# Altium schematic sheet 华怡丰ES201-D300N 2022版手抄原理图-20260610.SchDoc
size A4
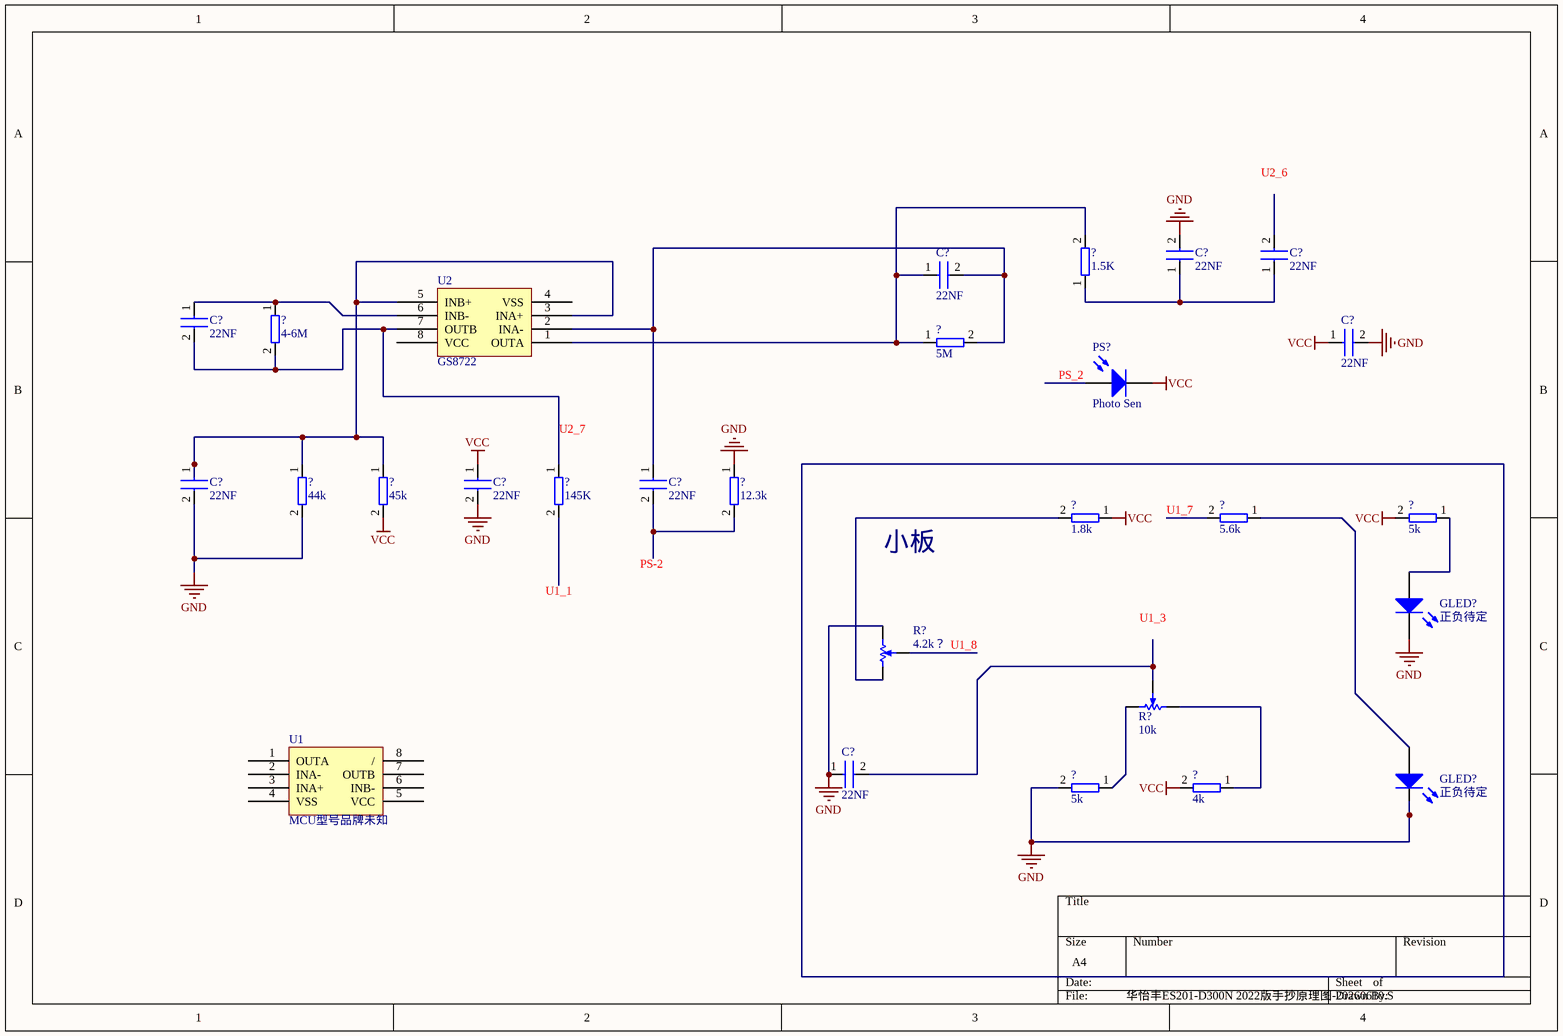
[diagram p0: 华怡丰ES201-D300N 2022版手抄原理图-20260610.SchDoc]

## Parts
(Parts that share a designator on the sheet are numbered #1, #2 ... from top to bottom, then left to right.)
?#1  1.5K
?#2  4-6M
?#3  5M
?#4  44k
?#5  45k
?#6  145K
?#7  12.3k
?#8  1.8k
?#9  5.6k
?#10  5k
?#11  5k
?#12  4k
C?#1  22NF
C?#2  22NF
C?#3  22NF
C?#4  22NF
C?#5  22NF
C?#6  22NF
C?#7  22NF
C?#8  22NF
C?#9  22NF
GLED?#1  正负待定  [LED-0]
GLED?#2  正负待定  [LED-0]
PS?  Photo Sen  [PIN2]
R?#1  4.2k？  [POT4MM-2]
R?#2  10k  [POT4MM-2]
U1  MCU型号品牌未知
U2  GS8722

## Nets
GND: ?#4.2 ?#7.1 ?#11.2 C?#2.2 C?#5.2 C?#6.2 C?#7.2 C?#9.1 GLED?#1.2(K) GLED?#2.2(K) R?#1.CW(+)
VCC: ?#5.2 ?#8.1 ?#10.2 ?#12.2 C?#5.1 C?#7.1 PS?.2(K)
Net?#1_1: ?#1.1 C?#2.1 C?#3.1
Net?#1_2: ?#1.2 ?#3.1 C?#1.1 U2.1(OUTA)
Net?#2_1: ?#2.1 C?#4.1 U2.6(INB-)
Net?#2_2: ?#2.2 ?#6.1 C?#4.2 U2.7(OUTB)
Net?#3_2: ?#3.2 C?#1.2 C?#8.1 U2.2(INA-)
Net?#4_1: ?#4.1 ?#5.1 C?#6.1 U2.3(INA+) U2.5(INB+)
Net?#7_2: ?#7.2 C?#8.2
Net?#8_2: ?#8.2 R?#1.CCW(-)
Net?#9_1: ?#9.1 GLED?#2.1(A)
Net?#10_1: ?#10.1 GLED?#1.1(A)
Net?#11_1: ?#11.1 R?#2.CW(+)
Net?#12_1: ?#12.1 R?#2.CCW(-)
NetC?#9_2: C?#9.2 R?#2.W

Not connected (* = marked no-connect by the designer): ?#6 2; ?#9 2; C?#3 2; PS? 1(A); R?#1 W; U1 1(OUTA) 2(INA-) 3(INA+) 4(VSS) 5(VCC) 6(INB-) 7(OUTB) 8(/); U2 4(VSS) 8(VCC)

## Notes on the sheet
- U2_6
- (near PS?) PS_2
- (near ?#6) U2_7
- (near ?#9) U1_7
- PS-2
- 小板
- U1_1
- U1_8
- U1_3

## Library data of the parts
?#1-?#12 = RES
C?#1-C?#9 = CAP
GLED?#1 GLED?#2 = LED0: Typical INFRARED GaAs LED; Published: 8-Jun-2000; LatestRevisionDate: 08-Jul-2005; LatestRevisionNote: Mech Layer 1 removed.; PackageReference: LED-0; Publisher: Altium Limited; PackageDescription: LED; 2 Leads
PS? = Photo Sen: Photosensitive Diode; Published: 24-Mar-1999; LatestRevisionDate: 17-Jul-2002; LatestRevisionNote: Re-released for DXP Platform.; PackageReference: PIN2; Publisher: Altium Limited
R?#1 R?#2 = RPot SM: Square Trimming Potentiometer; Published: 17-Dec-2003; DatasheetVersion: Oct-2003; PackageReference: POT4MM-2; Publisher: Altium Limited; PackageDescription: Square Trimming Potentiometer; ComponentLink1Description: Manufacturer Link; ComponentLink1URL: http://bourns.com/2/search.html
U1 U2 = GS358